# Altium schematic sheet DM1097_TopLevel.SchDoc: =project_title
size Tabloid; PageSetup: Record=PageOptions|CenterHorizontal=True|CenterVertical=True|PrintScale=0.73|XCorrection=1.00|YCorrection=1.00|PrintKind=0|BorderSize=5000000|LeftOffset=0|BottomOffset=0|Orientation=2|PaperLength=1000|PaperWidth=1000|Scale=100|PaperSource=7|PrintQuality=-4|MediaType=1|DitherType=10|PaperKind=A4|PrintScaleMode=1; CompanyName: Luxonis Holding; Organization: Luxonis Holding; Address1: 1925 Harmony Park Drive; Address2: Westminster, CO; Address3: 80234; Address4: United States; SheetNumber: 2; SheetTotal: 17
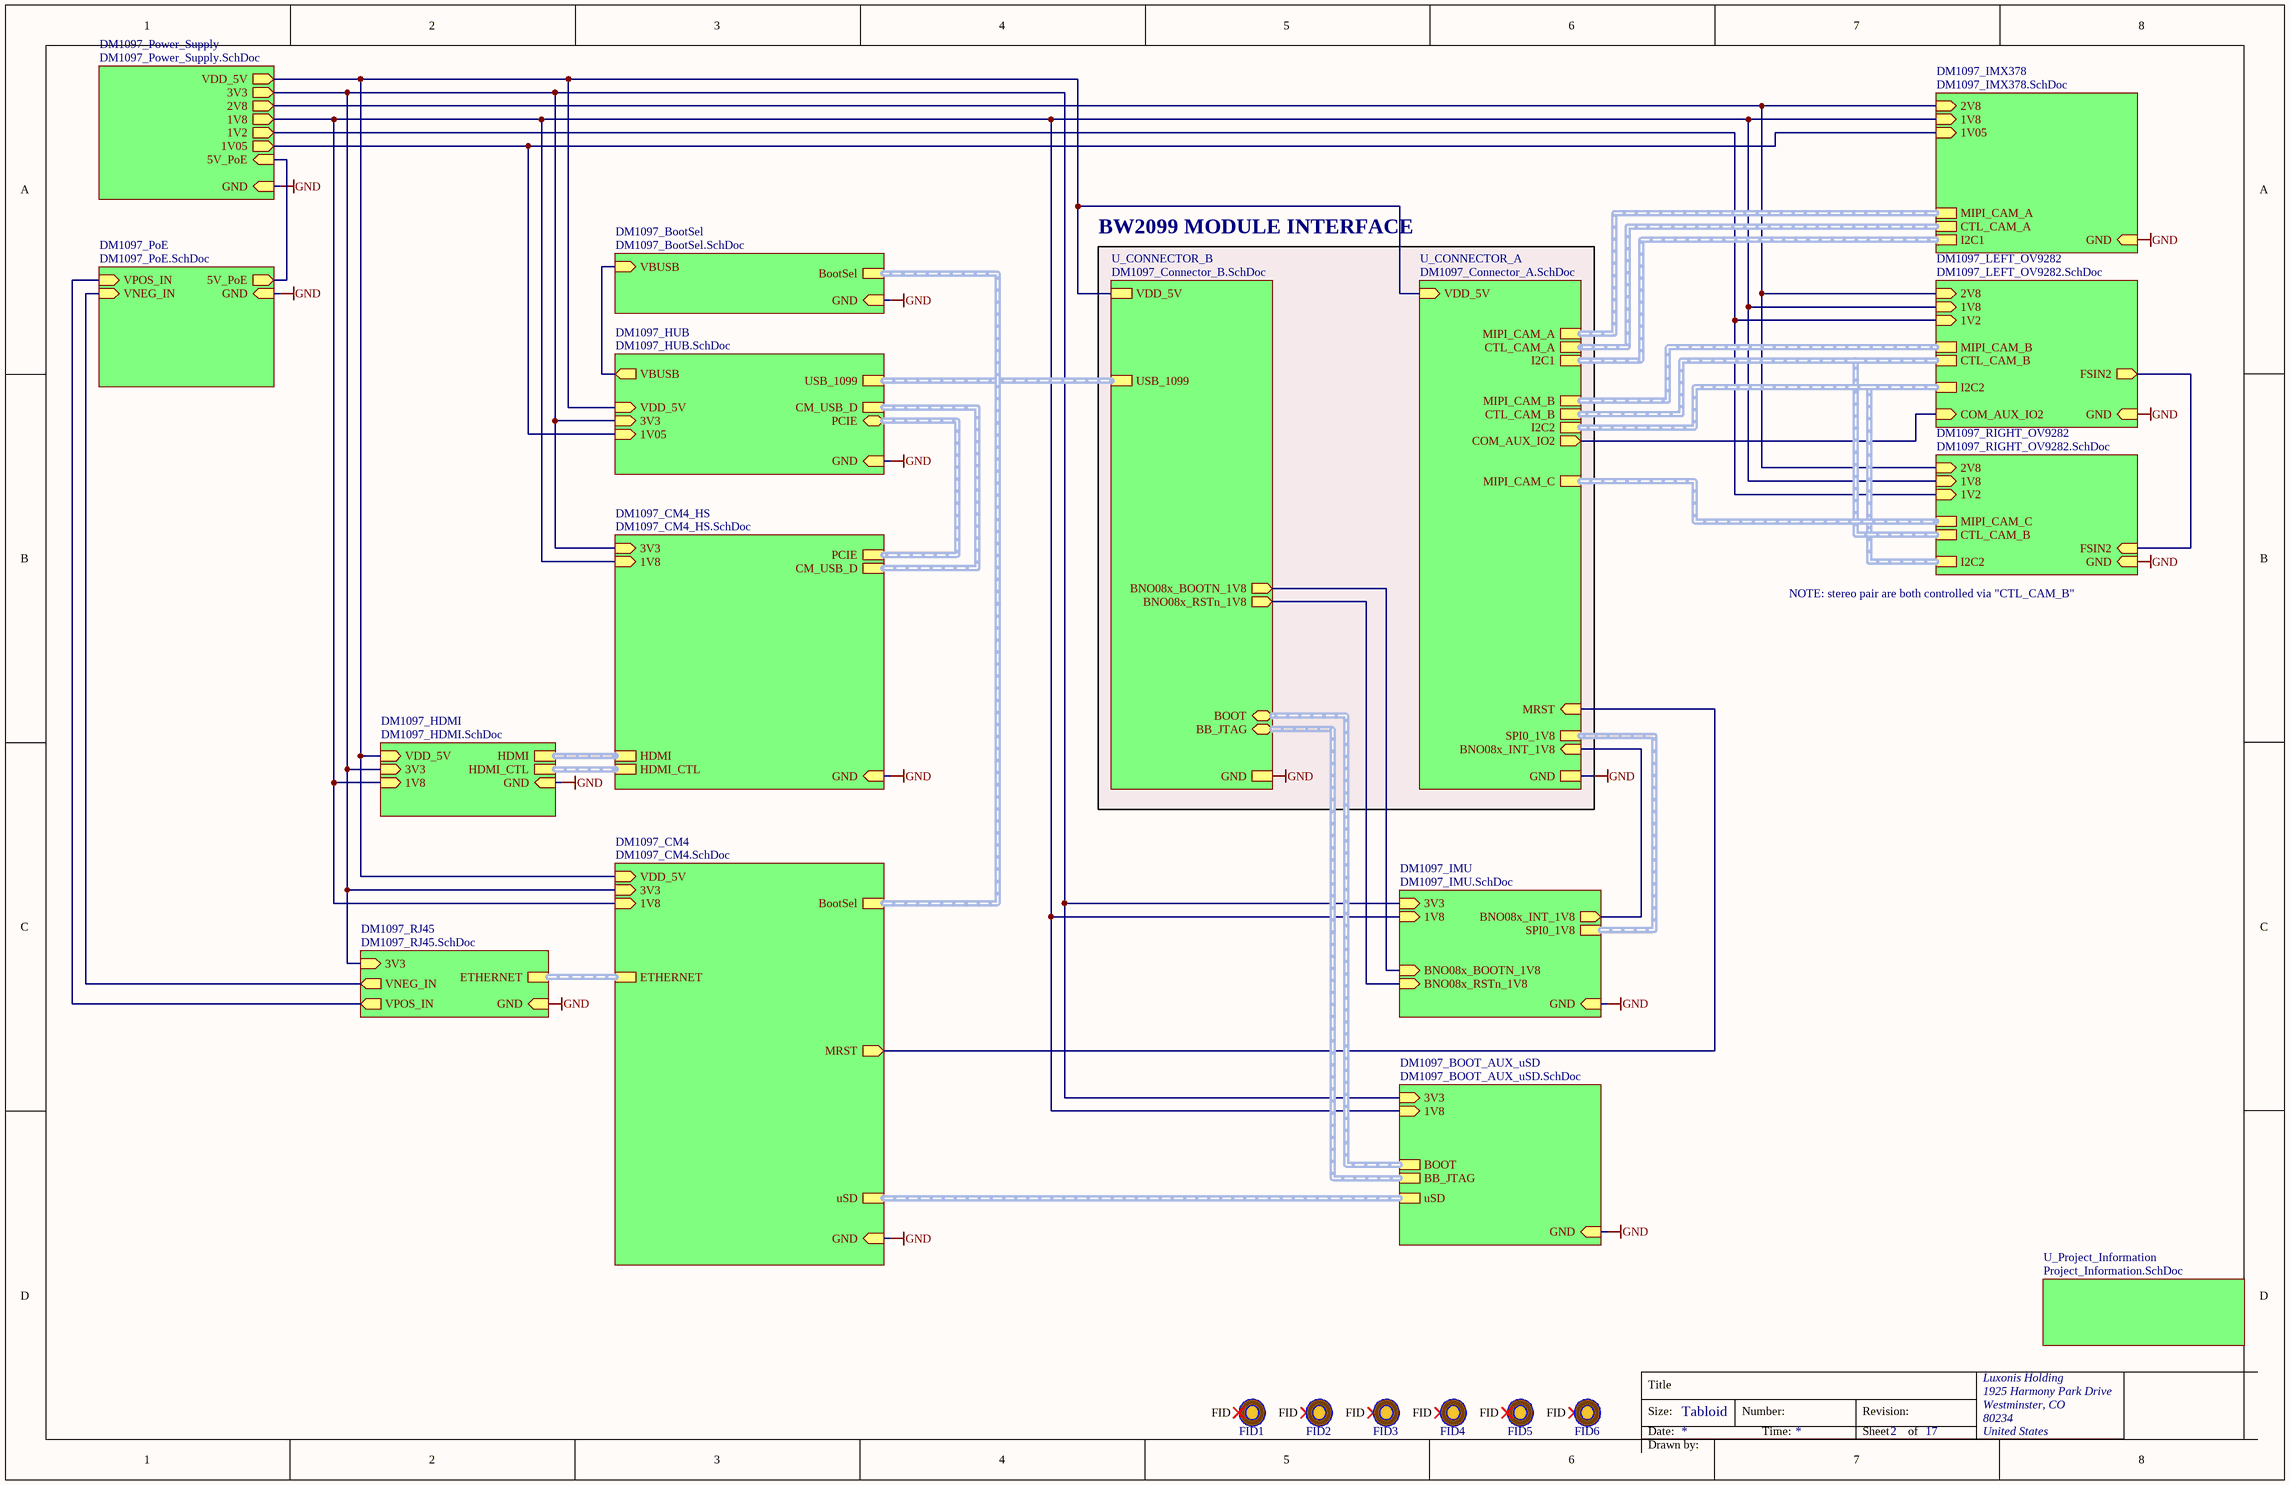
[diagram p0: DM1097_TopLevel.SchDoc]

## Parts
FID1  FIDUCIAL_ROUND_1MM  [FIDUCIAL_ROUND_1MM]  (value not drawn)  (no BOM)
FID2  FIDUCIAL_ROUND_1MM  [FIDUCIAL_ROUND_1MM]  (value not drawn)  (no BOM)
FID3  FIDUCIAL_ROUND_1MM  [FIDUCIAL_ROUND_1MM]  (value not drawn)  (no BOM)
FID4  FIDUCIAL_ROUND_1MM  [FIDUCIAL_ROUND_1MM]  (value not drawn)  (no BOM)
FID5  FIDUCIAL_ROUND_1MM  [FIDUCIAL_ROUND_1MM]  (value not drawn)  (no BOM)
FID6  FIDUCIAL_ROUND_1MM  [FIDUCIAL_ROUND_1MM]  (value not drawn)  (no BOM)

## Sub-sheets
DM1097_BOOT_AUX_uSD = DM1097_BOOT_AUX_uSD.SchDoc: uSD (harness uSD), 3V3 (in), GND (in), BB_JTAG (harness uSD), BOOT (harness uSD), 1V8 (in)
DM1097_BootSel = DM1097_BootSel.SchDoc: VBUSB (in), BootSel (harness BootSel), GND (in)
DM1097_CM4 = DM1097_CM4.SchDoc: GND (in), 3V3 (in), VDD_5V (in), BootSel (harness BootSel), ETHERNET (harness ETHERNET), 1V8 (in), MRST (out), uSD
DM1097_CM4_HS = DM1097_CM4_HS.SchDoc: HDMI (harness HDMI), HDMI_CTL (harness HDMI_CTL), GND (in), CM_USB_D, PCIE (harness PCIE), 3V3 (in), 1V8 (in)
DM1097_HDMI = DM1097_HDMI.SchDoc: HDMI_CTL (harness HDMI_CTL), HDMI (harness HDMI), 3V3 (in), GND (in), VDD_5V (in), 1V8 (in)
DM1097_HUB = DM1097_HUB.SchDoc: CM_USB_D (harness CM _USB_D), USB_1099 (harness USB_M), VDD_5V (in), 3V3 (in), GND (in), VBUSB (out), PCIE (bidir, harness Harness), 1V05 (in)
DM1097_IMU = DM1097_IMU.SchDoc: 3V3 (in), GND (in), SPI0_1V8 (harness uSD), BNO08x_INT_1V8 (out), BNO08x_BOOTN_1V8 (in), BNO08x_RSTn_1V8 (in), 1V8 (in)
DM1097_IMX378 = DM1097_IMX378.SchDoc: 2V8 (in), 1V05 (in), I2C1 (harness I2C1), MIPI_CAM_A (harness MIPI_CAM_A), CTL_CAM_A (harness CTL_CAM_A), GND (in), 1V8 (in)
DM1097_LEFT_OV9282 = DM1097_LEFT_OV9282.SchDoc: I2C2 (harness I2C2), CTL_CAM_B (harness CTL_CAM_B), MIPI_CAM_B (harness MIPI_CAM_B), 1V2 (in), 2V8 (in), GND (in), 1V8 (in), FSIN2 (out), COM_AUX_IO2 (in)
DM1097_PoE = DM1097_PoE.SchDoc: VNEG_IN (in), VPOS_IN (in), 5V_PoE (out), GND (in)
DM1097_Power_Supply = DM1097_Power_Supply.SchDoc: 1V8 (out), 2V8 (out), 1V05 (out), VDD_5V (out), GND (in), 3V3 (out), 1V2 (out), 5V_PoE (in)
DM1097_RIGHT_OV9282 = DM1097_RIGHT_OV9282.SchDoc: I2C2 (harness I2C2), 1V2 (in), 2V8 (in), GND (in), 1V8 (in), FSIN2 (in), MIPI_CAM_C (harness MIPI_CAM_C), CTL_CAM_B (harness CTL_CAM_B)
DM1097_RJ45 = DM1097_RJ45.SchDoc: 3V3 (in), ETHERNET (harness ETHERNET), GND (in), VNEG_IN (out), VPOS_IN (out)
U_CONNECTOR_A = DM1097_Connector_A.SchDoc: I2C2 (harness I2C2), I2C1 (harness I2C1), MIPI_CAM_C (harness MIPI_CAM_C), CTL_CAM_A (harness CTL_CAM_A), MIPI_CAM_A (harness MIPI_CAM_A), MIPI_CAM_B (harness MIPI_CAM_B), GND, CTL_CAM_B (harness CTL_CAM_B), COM_AUX_IO2 (out), MRST (in), BNO08x_INT_1V8 (in), SPI0_1V8, VDD_5V (in)
U_CONNECTOR_B = DM1097_Connector_B.SchDoc: VDD_5V, GND, BOOT (bidir, harness BOOT), BB_JTAG (bidir, harness BB_JTAG), USB_1099, BNO08x_BOOTN_1V8 (out), BNO08x_RSTn_1V8 (out)
U_Project_Information = Project_Information.SchDoc: no entries

## Nets
GND: sheet DM1097_IMX378/GND, sheet DM1097_CM4/GND, sheet DM1097_BOOT_AUX_uSD/GND, sheet DM1097_BootSel/GND, sheet DM1097_HUB/GND, sheet DM1097_RJ45/GND, sheet DM1097_RIGHT_OV9282/GND, sheet DM1097_LEFT_OV9282/GND, sheet DM1097_Power_Supply/GND, sheet DM1097_HDMI/GND, sheet DM1097_CM4_HS/GND, sheet DM1097_PoE/GND, sheet U_CONNECTOR_B/GND, sheet U_CONNECTOR_A/GND, sheet DM1097_IMU/GND
(unnamed): sheet DM1097_IMX378/2V8, sheet DM1097_RIGHT_OV9282/2V8, sheet DM1097_LEFT_OV9282/2V8, sheet DM1097_Power_Supply/2V8
(unnamed): sheet DM1097_IMX378/1V05, sheet DM1097_HUB/1V05, sheet DM1097_Power_Supply/1V05
(unnamed): sheet DM1097_IMX378/1V8, sheet DM1097_CM4/1V8, sheet DM1097_BOOT_AUX_uSD/1V8, sheet DM1097_RIGHT_OV9282/1V8, sheet DM1097_LEFT_OV9282/1V8, sheet DM1097_Power_Supply/1V8, sheet DM1097_HDMI/1V8, sheet DM1097_CM4_HS/1V8, sheet DM1097_IMU/1V8
(unnamed): sheet DM1097_CM4/3V3, sheet DM1097_BOOT_AUX_uSD/3V3, sheet DM1097_HUB/3V3, sheet DM1097_RJ45/3V3, sheet DM1097_Power_Supply/3V3, sheet DM1097_HDMI/3V3, sheet DM1097_CM4_HS/3V3, sheet DM1097_IMU/3V3
(unnamed): sheet DM1097_CM4/VDD_5V, sheet DM1097_HUB/VDD_5V, sheet DM1097_Power_Supply/VDD_5V, sheet DM1097_HDMI/VDD_5V, sheet U_CONNECTOR_B/VDD_5V, sheet U_CONNECTOR_A/VDD_5V
(unnamed): sheet DM1097_CM4/MRST, sheet U_CONNECTOR_A/MRST
(unnamed): sheet DM1097_BootSel/VBUSB, sheet DM1097_HUB/VBUSB
(unnamed): sheet DM1097_RJ45/VNEG_IN, sheet DM1097_PoE/VNEG_IN
(unnamed): sheet DM1097_RJ45/VPOS_IN, sheet DM1097_PoE/VPOS_IN
(unnamed): sheet DM1097_RIGHT_OV9282/1V2, sheet DM1097_LEFT_OV9282/1V2, sheet DM1097_Power_Supply/1V2
(unnamed): sheet DM1097_RIGHT_OV9282/FSIN2, sheet DM1097_LEFT_OV9282/FSIN2
(unnamed): sheet DM1097_LEFT_OV9282/COM_AUX_IO2, sheet U_CONNECTOR_A/COM_AUX_IO2
(unnamed): sheet DM1097_Power_Supply/5V_PoE, sheet DM1097_PoE/5V_PoE
(unnamed): sheet U_CONNECTOR_B/BNO08x_BOOTN_1V8, sheet DM1097_IMU/BNO08x_BOOTN_1V8
(unnamed): sheet U_CONNECTOR_B/BNO08x_RSTn_1V8, sheet DM1097_IMU/BNO08x_RSTn_1V8
(unnamed): sheet U_CONNECTOR_A/BNO08x_INT_1V8, sheet DM1097_IMU/BNO08x_INT_1V8

Not connected (* = marked no-connect by the designer): FID1 FID*; FID2 FID*; FID3 FID*; FID4 FID*; FID5 FID*; FID6 FID*

## Buses and harness runs
harness sheet DM1097_BOOT_AUX_uSD/BB_JTAG = sheet U_CONNECTOR_B/BB_JTAG
harness sheet DM1097_BOOT_AUX_uSD/BOOT = sheet U_CONNECTOR_B/BOOT
harness sheet DM1097_BOOT_AUX_uSD/uSD = sheet DM1097_CM4/uSD
harness sheet DM1097_BootSel/BootSel = sheet DM1097_CM4/BootSel
harness sheet DM1097_CM4/ETHERNET = sheet DM1097_RJ45/ETHERNET
harness sheet DM1097_CM4_HS/CM_USB_D = sheet DM1097_HUB/CM_USB_D
harness sheet DM1097_CM4_HS/HDMI = sheet DM1097_HDMI/HDMI
harness sheet DM1097_CM4_HS/HDMI_CTL = sheet DM1097_HDMI/HDMI_CTL
harness sheet DM1097_CM4_HS/PCIE = sheet DM1097_HUB/PCIE
harness sheet DM1097_HUB/USB_1099 = sheet U_CONNECTOR_B/USB_1099
harness sheet DM1097_IMU/SPI0_1V8 = sheet U_CONNECTOR_A/SPI0_1V8
harness sheet DM1097_IMX378/CTL_CAM_A = sheet U_CONNECTOR_A/CTL_CAM_A
harness sheet DM1097_IMX378/I2C1 = sheet U_CONNECTOR_A/I2C1
harness sheet DM1097_IMX378/MIPI_CAM_A = sheet U_CONNECTOR_A/MIPI_CAM_A
harness sheet DM1097_LEFT_OV9282/CTL_CAM_B = sheet DM1097_RIGHT_OV9282/CTL_CAM_B = sheet U_CONNECTOR_A/CTL_CAM_B
harness sheet DM1097_LEFT_OV9282/I2C2 = sheet DM1097_RIGHT_OV9282/I2C2 = sheet U_CONNECTOR_A/I2C2
harness sheet DM1097_LEFT_OV9282/MIPI_CAM_B = sheet U_CONNECTOR_A/MIPI_CAM_B
harness sheet DM1097_RIGHT_OV9282/MIPI_CAM_C = sheet U_CONNECTOR_A/MIPI_CAM_C

## Notes on the sheet
- BW2099 MODULE INTERFACE
- NOTE: stereo pair are both controlled via "CTL_CAM_B"
- Title
- Size:
- Date:
- Tabloid
- Number:
- Time:
- Revision:
- Sheet
- of
- Drawn by:

## Library data of the parts
FID1-FID6 = FIDUCIAL: Fiducial with various available footprints